# Altium schematic sheet Input Devices.SchDoc
size A; SheetNumber: 4; SheetTotal: 5
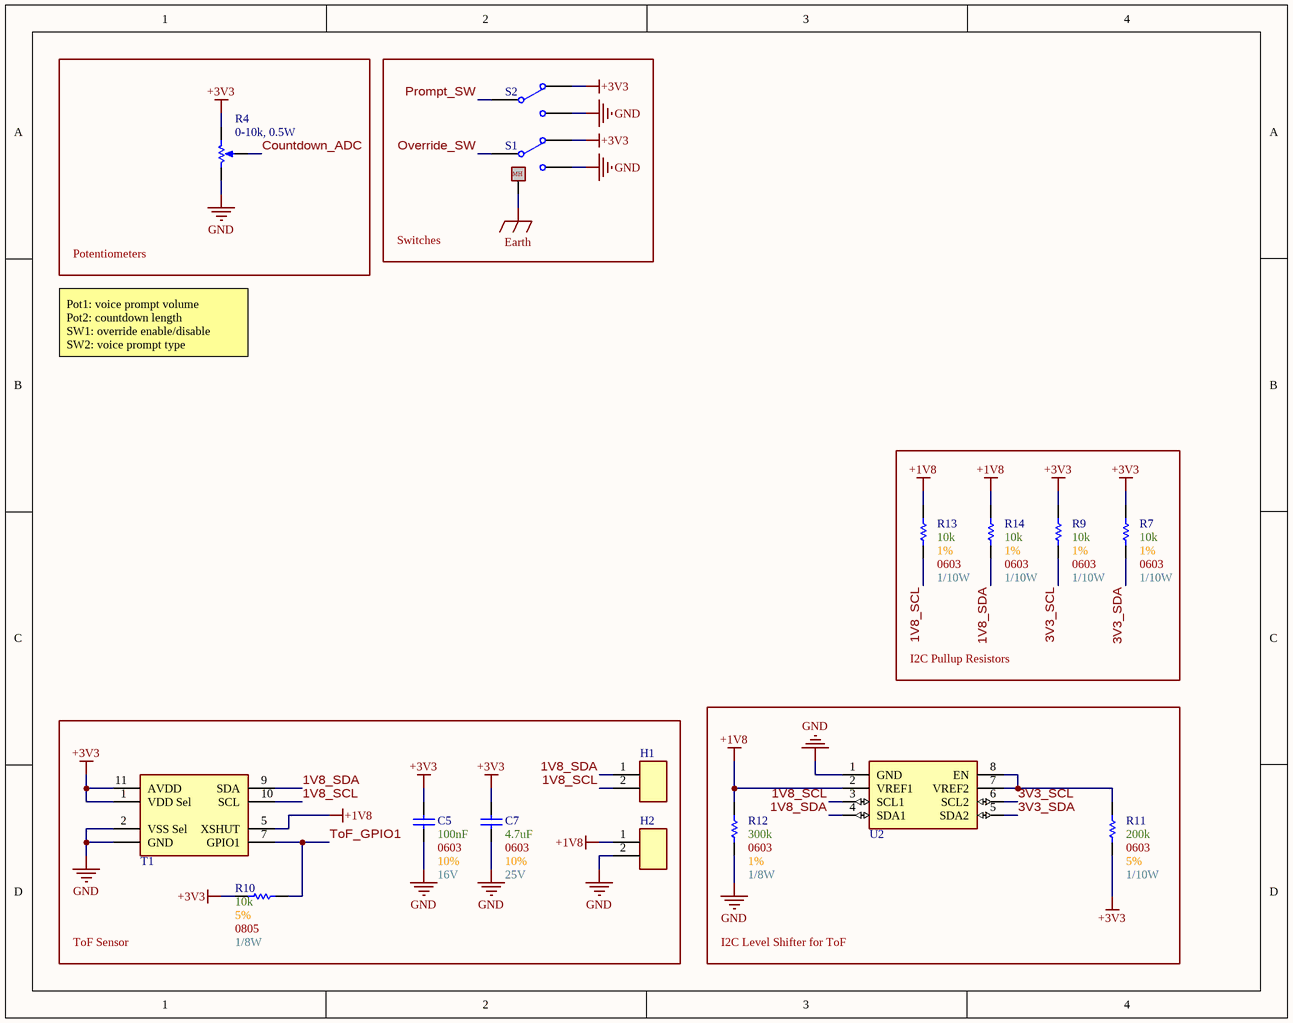
[diagram p0: Input Devices.SchDoc]

## Parts
C5  Max Voltage: 16V  Size Package: 0603  Tolerance: 10%  Capacitance: 100nF  [[Cap] SMD 0603]  (hidden comment: [Cap] 0603 0.1uF 10% 16V)
C7  Max Voltage: 25V  Size Package: 0603  Tolerance: 10%  Capacitance: 4.7uF  [[Cap] SMD 0603]  (hidden comment: [Cap] 0603 4.7uF 10% 25V)
H1  1x2 Header  [[Header] 1x2 Male]  (value not drawn)
H2  1x2 Header  [[Header] 1x2 Male]  (value not drawn)
R4  0-10k, 0.5W  [[Potentiometer] 10k 0.5W (2)]
R7  Wattage: 1/10W  Tolerance: 1%  Resistance: 10k  Size Package: 0603  [[Res] SMD 0603]  (hidden comment: [10k] SMD 0603 1% 1/8W)
R9  Wattage: 1/10W  Tolerance: 1%  Resistance: 10k  Size Package: 0603  [[Res] SMD 0603]  (hidden comment: [10k] SMD 0603 1% 1/8W)
R10  Wattage: 1/8W  Tolerance: 5%  Resistance: 10k  Size Package: 0805  [[Res] SMD 0603]  (hidden comment: [10k] SMD 0603 1% 1/8W)
R11  Wattage: 1/10W  Tolerance: 5%  Resistance: 200k  Size Package: 0603  [[Res] SMD 0603]  (hidden comment: [200k] SMD 0603 1% 1/10W)
R12  Wattage: 1/8W  Tolerance: 1%  Resistance: 300k  Size Package: 0603  [[Res] SMD 0603]  (hidden comment: [300k] SMD 0603 1% 1/10W)
R13  Wattage: 1/10W  Tolerance: 1%  Resistance: 10k  Size Package: 0603  [[Res] SMD 0603]  (hidden comment: [10k] SMD 0603 1% 1/8W)
R14  Wattage: 1/10W  Tolerance: 1%  Resistance: 10k  Size Package: 0603  [[Res] SMD 0603]  (hidden comment: [10k] SMD 0603 1% 1/8W)
S1  [SPDT] Toggle  [[SPDT] Toggle]  (value not drawn)
S2  [SPDT] Slide Switch  [[SPDT] Slide Switch]  (value not drawn)
T1  [ToF] VL53L1X  [[ToF] VL53L1X]  (value not drawn)
U2  [Level Shifter] I2C Level Shifter  [[Level Shifter] I2C Level Shifter]  (value not drawn)

## Blocks framed on the sheet
Potentiometers: R4
Switches: S1 S2
I2C Pullup Resistors: R7 R9 R13 R14
ToF Sensor: C5 C7 H1 H2 R10 T1
I2C Level Shifter for ToF: R11 R12 U2

## Nets
+1V8: H2.1 R12.2 R13.2 R14.2 T1.5(XSHUT) U2.2(VREF1)
+3V3: C5.2 C7.2 R4.1(TOP) R7.2 R9.2 R10.2 R11.1 S1.3 S2.3 T1.1(VDD_Sel) T1.11(AVDD)
Earth: S1.X(Mount_Hole)
GND: C5.1 C7.1 H2.2 R4.3(BOT) R12.1 S1.1 S2.1 T1.2(VSS_Sel) T1.GND U2.1(GND)
1V8_SCL: H1.2 R13.1 T1.10(SCL) U2.3(SCL1)
1V8_SDA: H1.1 R14.1 T1.9(SDA) U2.4(SDA1)
3V3_SCL: R9.1 U2.6(SCL2)
3V3_SDA: R7.1 U2.5(SDA2)
Countdown_ADC: R4.2(TAP)
Override_SW: S1.2
Prompt_SW: S2.2
ToF_GPIO1: R10.1 T1.7(GPIO1)
NetR11_2: R11.2 U2.7(VREF2) U2.8(EN)

## Notes on the sheet
- Pot1: voice prompt volume
  Pot2: countdown length
  SW1: override enable/disable
  SW2: voice prompt type
- (in symbol [SPDT] Toggle) MH

## Library data of the parts
C5 = [Cap] 0603 0.1uF 10% 16V: CC0603KRX7R7BB104; Supplier 1: DigiKey; Supplier Part Number 1: 311-1088-6-ND
C7 = [Cap] 0603 4.7uF 10% 25V: GRM188R61E475KE11D; Supplier 1: DigiKey; Supplier Part Number 1: 490-7203-6-ND
H1 H2 = [Header] 1x2 Male: 2.54mm pitch
R4 = [Potentiometer] 10k 0.5W: 3386T-1-103LF; Supplier 1: DigiKey; Supplier Part Number 1: 118-3386T-1-103LF-ND
R7 R9 R13 R14 = [10k] SMD 0603 1% 1/8W: RMCF0603FT10K0; Supplier 1: DigiKey; Supplier Part Number 1: RMCF0603FT10K0DKR-ND
R10 = [10k] SMD 0603 1% 1/8W: RC0805JR-0710KL; Supplier 1: DigiKey; Supplier Part Number 1: 311-10KARCT-ND
R11 = [200k] SMD 0603 1% 1/10W: RC0603JR-07200KL; Supplier 1: DigiKey; Supplier Part Number 1: 311-200KGRCT-ND
R12 = [300k] SMD 0603 1% 1/10W: CRCW0603300KFKEA; Supplier 1: DigiKey; Supplier Part Number 1: 541-300KHCT-ND
S1 = [SPDT] Toggle: ANT11TFHQE; Supplier 1: DigiKey; Supplier Part Number 1: 2449-ANT11TFHQE-ND
S2 = [SPDT] Slide Switch: 09.03290.01; Supplier 1: DigiKey; Supplier Part Number 1: 1948-1087-ND
T1 = [ToF] VL53L1X: VL53L1CXV0FY/1; Supplier 1: DigiKey; Supplier Part Number 1: 497-17764-1-ND
U2 = [Level Shifter] I2C Level Shifter: PCA9306DCTR; Supplier 1: DigiKey; Supplier Part Number 1: 296-18509-1-ND